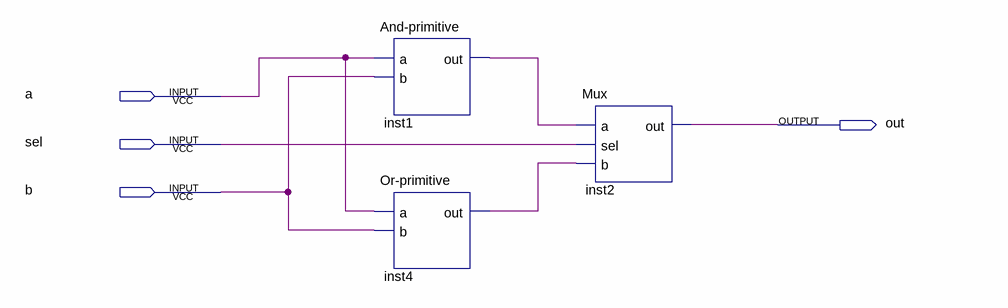
[diagram p0: schematic sheet]
// Quartus schematic AndMuxOr.bdf as structural Verilog: 3 symbols, 4 pins
module AndMuxOr (
  input  a,
  input  sel,
  input  b,
  output out
);

  wire inst1_out, inst4_out;

  \And-primitive  inst1 (.a(a), .b(b), .out(inst1_out));
  \Or-primitive  inst4 (.a(a), .b(b), .out(inst4_out));
  Mux inst2 (.a(inst1_out), .sel(sel), .b(inst4_out), .out(out));
endmodule
